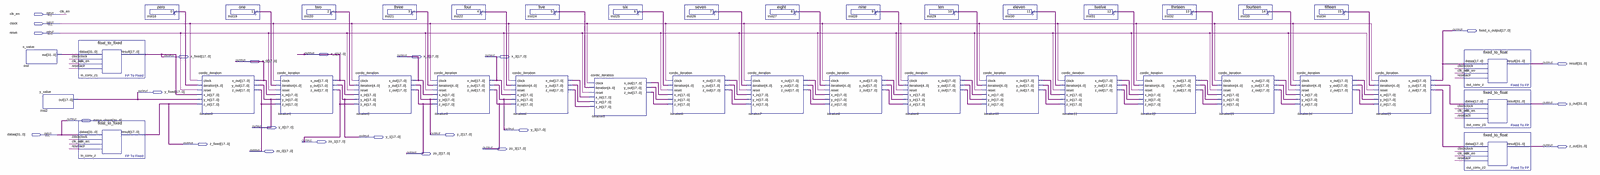
[diagram p0: schematic sheet, whole]
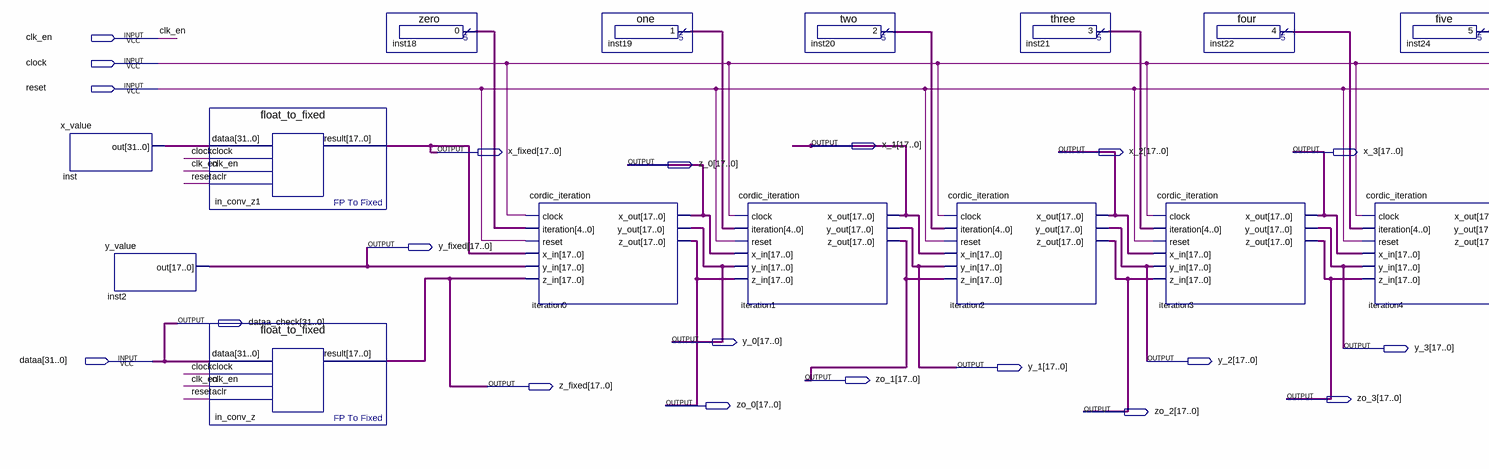
[diagram p1: schematic sheet, left part]
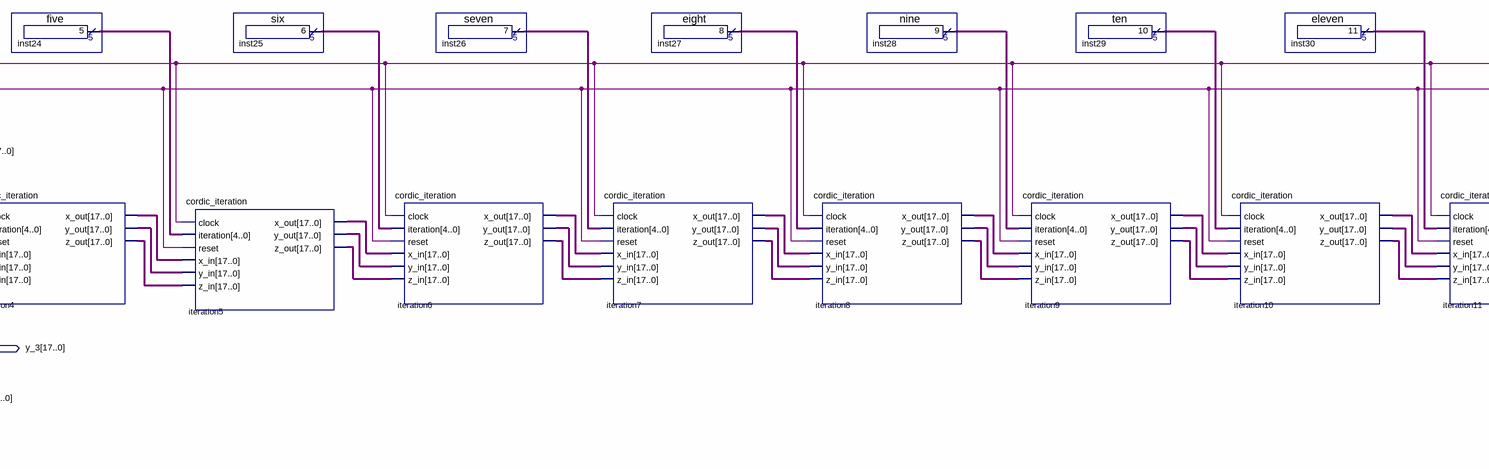
[diagram p2: schematic sheet, centre part]
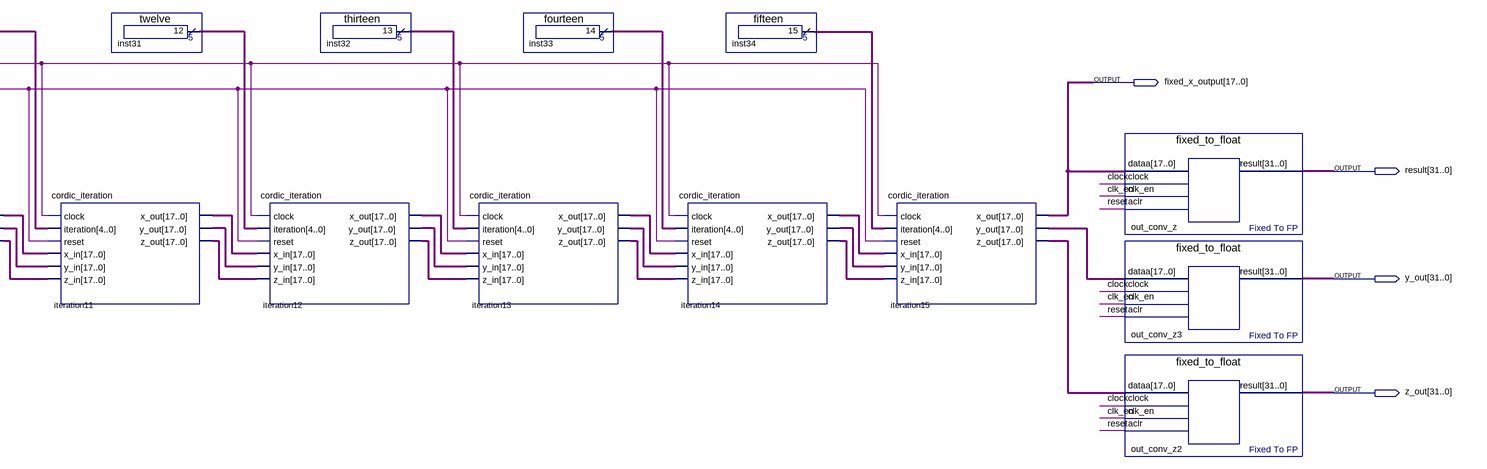
[diagram p3: schematic sheet, right part]
// Quartus schematic cordic_unrolled.bdf as structural Verilog: 39 symbols, 24 pins
module cordic_unrolled (
  input  clk_en,
  input  clock,
  input  reset,
  input  [31:0] dataa,
  output [17:0] fixed_x_output,
  output [17:0] x_1,
  output [17:0] x_fixed,
  output [17:0] x_2,
  output [17:0] x_3,
  output [17:0] z_0,
  output [31:0] result,
  output [17:0] y_fixed,
  output [31:0] y_out,
  output [31:0] dataa_check,
  output [17:0] y_0,
  output [17:0] y_3,
  output [17:0] y_2,
  output [17:0] y_1,
  output [17:0] zo_1,
  output [17:0] z_fixed,
  output [31:0] z_out,
  output [17:0] zo_3,
  output [17:0] zo_0,
  output [17:0] zo_2
);

  wire [4:0] inst18_result, inst19_result, inst20_result, inst21_result, inst22_result, inst24_result,
       inst25_result, inst26_result, inst27_result, inst28_result, inst29_result, inst30_result,
       inst31_result, inst32_result, inst33_result, inst34_result;
  wire [17:0] iteration4_x_out, iteration4_y_out, iteration4_z_out, iteration5_x_out, iteration5_y_out,
       iteration5_z_out, iteration6_x_out, iteration6_y_out, iteration6_z_out, iteration7_x_out,
       iteration7_y_out, iteration7_z_out, iteration8_x_out, iteration8_y_out, iteration8_z_out,
       iteration9_x_out, iteration9_y_out, iteration9_z_out, iteration10_x_out, iteration10_y_out,
       iteration10_z_out, iteration11_x_out, iteration11_y_out, iteration11_z_out, iteration12_x_out,
       iteration12_y_out, iteration12_z_out, iteration13_x_out, iteration13_y_out, iteration13_z_out,
       iteration14_x_out, iteration14_y_out, iteration14_z_out, iteration15_y_out, iteration15_z_out;
  wire [31:0] inst_out;

  x_value inst (.out(inst_out));
  y_value inst2 (.out(y_fixed));
  float_to_fixed in_conv_z1 (.dataa(inst_out), .clock(clock), .clk_en(clk_en), .aclr(reset), .result(x_fixed));
  float_to_fixed in_conv_z (.dataa(dataa), .clock(clock), .clk_en(clk_en), .aclr(reset), .result(z_fixed));
  zero inst18 (.result(inst18_result));
  cordic_iteration iteration0 (
    .clock(clock), .iteration(inst18_result), .reset(reset), .x_in(x_fixed), .y_in(y_fixed), .z_in(z_fixed),
    .x_out(z_0), .y_out(y_0), .z_out(zo_0));
  one inst19 (.result(inst19_result));
  cordic_iteration iteration1 (
    .clock(clock), .iteration(inst19_result), .reset(reset), .x_in(z_0), .y_in(y_0), .z_in(zo_0),
    .x_out(x_1), .y_out(y_1), .z_out(zo_1));
  two inst20 (.result(inst20_result));
  cordic_iteration iteration2 (
    .clock(clock), .iteration(inst20_result), .reset(reset), .x_in(x_1), .y_in(y_1), .z_in(zo_1),
    .x_out(x_2), .y_out(y_2), .z_out(zo_2));
  three inst21 (.result(inst21_result));
  cordic_iteration iteration3 (
    .clock(clock), .iteration(inst21_result), .reset(reset), .x_in(x_2), .y_in(y_2), .z_in(zo_2),
    .x_out(x_3), .y_out(y_3), .z_out(zo_3));
  four inst22 (.result(inst22_result));
  five inst24 (.result(inst24_result));
  cordic_iteration iteration4 (
    .clock(clock), .iteration(inst22_result), .reset(reset), .x_in(x_3), .y_in(y_3), .z_in(zo_3),
    .x_out(iteration4_x_out), .y_out(iteration4_y_out), .z_out(iteration4_z_out));
  cordic_iteration iteration5 (
    .clock(clock), .iteration(inst24_result), .reset(reset), .x_in(iteration4_x_out),
    .y_in(iteration4_y_out), .z_in(iteration4_z_out), .x_out(iteration5_x_out), .y_out(iteration5_y_out),
    .z_out(iteration5_z_out));
  six inst25 (.result(inst25_result));
  cordic_iteration iteration6 (
    .clock(clock), .iteration(inst25_result), .reset(reset), .x_in(iteration5_x_out),
    .y_in(iteration5_y_out), .z_in(iteration5_z_out), .x_out(iteration6_x_out), .y_out(iteration6_y_out),
    .z_out(iteration6_z_out));
  seven inst26 (.result(inst26_result));
  cordic_iteration iteration7 (
    .clock(clock), .iteration(inst26_result), .reset(reset), .x_in(iteration6_x_out),
    .y_in(iteration6_y_out), .z_in(iteration6_z_out), .x_out(iteration7_x_out), .y_out(iteration7_y_out),
    .z_out(iteration7_z_out));
  eight inst27 (.result(inst27_result));
  cordic_iteration iteration8 (
    .clock(clock), .iteration(inst27_result), .reset(reset), .x_in(iteration7_x_out),
    .y_in(iteration7_y_out), .z_in(iteration7_z_out), .x_out(iteration8_x_out), .y_out(iteration8_y_out),
    .z_out(iteration8_z_out));
  nine inst28 (.result(inst28_result));
  cordic_iteration iteration9 (
    .clock(clock), .iteration(inst28_result), .reset(reset), .x_in(iteration8_x_out),
    .y_in(iteration8_y_out), .z_in(iteration8_z_out), .x_out(iteration9_x_out), .y_out(iteration9_y_out),
    .z_out(iteration9_z_out));
  ten inst29 (.result(inst29_result));
  cordic_iteration iteration10 (
    .clock(clock), .iteration(inst29_result), .reset(reset), .x_in(iteration9_x_out),
    .y_in(iteration9_y_out), .z_in(iteration9_z_out), .x_out(iteration10_x_out), .y_out(iteration10_y_out),
    .z_out(iteration10_z_out));
  eleven inst30 (.result(inst30_result));
  cordic_iteration iteration11 (
    .clock(clock), .iteration(inst30_result), .reset(reset), .x_in(iteration10_x_out),
    .y_in(iteration10_y_out), .z_in(iteration10_z_out), .x_out(iteration11_x_out), .y_out(iteration11_y_out),
    .z_out(iteration11_z_out));
  twelve inst31 (.result(inst31_result));
  cordic_iteration iteration12 (
    .clock(clock), .iteration(inst31_result), .reset(reset), .x_in(iteration11_x_out),
    .y_in(iteration11_y_out), .z_in(iteration11_z_out), .x_out(iteration12_x_out), .y_out(iteration12_y_out),
    .z_out(iteration12_z_out));
  thirteen inst32 (.result(inst32_result));
  cordic_iteration iteration13 (
    .clock(clock), .iteration(inst32_result), .reset(reset), .x_in(iteration12_x_out),
    .y_in(iteration12_y_out), .z_in(iteration12_z_out), .x_out(iteration13_x_out), .y_out(iteration13_y_out),
    .z_out(iteration13_z_out));
  fourteen inst33 (.result(inst33_result));
  cordic_iteration iteration14 (
    .clock(clock), .iteration(inst33_result), .reset(reset), .x_in(iteration13_x_out),
    .y_in(iteration13_y_out), .z_in(iteration13_z_out), .x_out(iteration14_x_out), .y_out(iteration14_y_out),
    .z_out(iteration14_z_out));
  fifteen inst34 (.result(inst34_result));
  cordic_iteration iteration15 (
    .clock(clock), .iteration(inst34_result), .reset(reset), .x_in(iteration14_x_out),
    .y_in(iteration14_y_out), .z_in(iteration14_z_out), .x_out(fixed_x_output), .y_out(iteration15_y_out),
    .z_out(iteration15_z_out));
  fixed_to_float out_conv_z (.dataa(fixed_x_output), .clock(clock), .clk_en(clk_en), .aclr(reset), .result(result));
  fixed_to_float out_conv_z3 (.dataa(iteration15_y_out), .clock(clock), .clk_en(clk_en), .aclr(reset), .result(y_out));
  fixed_to_float out_conv_z2 (.dataa(iteration15_z_out), .clock(clock), .clk_en(clk_en), .aclr(reset), .result(z_out));

  assign dataa_check = dataa;
endmodule
